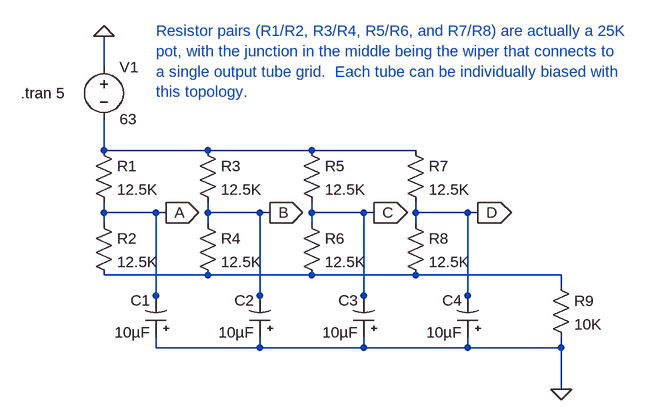
[diagram p0: schematic Individual_Bias_Network.asc]
Individual_Bias_Network.asc, the LTspice schematic file:
Version 4
SHEET 1 1040 680
WIRE 224 48 224 0
WIRE 224 176 224 128
WIRE 384 176 224 176
WIRE 544 176 384 176
WIRE 704 176 544 176
WIRE 224 272 224 256
WIRE 304 272 224 272
WIRE 320 272 304 272
WIRE 384 272 384 256
WIRE 464 272 384 272
WIRE 480 272 464 272
WIRE 544 272 544 256
WIRE 624 272 544 272
WIRE 640 272 624 272
WIRE 704 272 704 256
WIRE 784 272 704 272
WIRE 800 272 784 272
WIRE 224 288 224 272
WIRE 384 288 384 272
WIRE 544 288 544 272
WIRE 704 288 704 272
WIRE 384 368 224 368
WIRE 544 368 384 368
WIRE 704 368 544 368
WIRE 928 368 704 368
WIRE 928 384 928 368
WIRE 304 400 304 272
WIRE 464 400 464 272
WIRE 624 400 624 272
WIRE 784 400 784 272
WIRE 304 416 304 400
WIRE 464 416 464 400
WIRE 624 416 624 400
WIRE 784 416 784 400
WIRE 304 480 304 464
WIRE 464 480 464 464
WIRE 464 480 304 480
WIRE 624 480 624 464
WIRE 624 480 464 480
WIRE 784 480 784 464
WIRE 784 480 624 480
WIRE 928 480 928 464
WIRE 928 480 784 480
WIRE 928 544 928 480
FLAG 928 544 0
FLAG 224 0 0
FLAG 320 272 A
IOPIN 320 272 Out
FLAG 480 272 B
IOPIN 480 272 Out
FLAG 640 272 C
IOPIN 640 272 Out
FLAG 800 272 D
IOPIN 800 272 Out
SYMBOL res 208 160 R0
SYMATTR InstName R1
SYMATTR Value 12.5K
SYMBOL res 208 272 R0
SYMATTR InstName R2
SYMATTR Value 12.5K
SYMBOL res 368 160 R0
SYMATTR InstName R3
SYMATTR Value 12.5K
SYMBOL res 368 272 R0
SYMATTR InstName R4
SYMATTR Value 12.5K
SYMBOL res 528 160 R0
SYMATTR InstName R5
SYMATTR Value 12.5K
SYMBOL res 528 272 R0
SYMATTR InstName R6
SYMATTR Value 12.5K
SYMBOL res 688 160 R0
SYMATTR InstName R7
SYMATTR Value 12.5K
SYMBOL res 688 272 R0
SYMATTR InstName R8
SYMATTR Value 12.5K
SYMBOL res 912 368 R0
SYMATTR InstName R9
SYMATTR Value 10K
SYMBOL polcap 320 464 R180
WINDOW 0 24 57 Left 2
WINDOW 3 24 8 Left 2
SYMATTR InstName C1
SYMATTR Value 10µF
SYMBOL polcap 480 464 R180
WINDOW 0 24 57 Left 2
WINDOW 3 24 8 Left 2
SYMATTR InstName C2
SYMATTR Value 10µF
SYMBOL polcap 640 464 R180
WINDOW 0 24 57 Left 2
WINDOW 3 24 8 Left 2
SYMATTR InstName C3
SYMATTR Value 10µF
SYMBOL polcap 800 464 R180
WINDOW 0 24 57 Left 2
WINDOW 3 24 8 Left 2
SYMATTR InstName C4
SYMATTR Value 10µF
SYMBOL voltage 224 32 R0
SYMATTR InstName V1
SYMATTR Value 63
TEXT 96 88 Left 2 !.tran 5
TEXT 304 -8 Left 2 ;Resistor pairs (R1/R2, R3/R4, R5/R6, and R7/R8) are actually a 25K\npot, with the junction in the middle being the wiper that connects to\na single output tube grid.  Each tube can be individually biased with\nthis topology.

The netlist it stands for:
* Individual_Bias_Network.asc
R1 N001 A 12.5K
R2 A N002 12.5K
R3 N001 B 12.5K
R4 B N002 12.5K
R5 N001 C 12.5K
R6 C N002 12.5K
R7 N001 D 12.5K
R8 D N002 12.5K
R9 N002 0 10K
C1 0 A 10µF
C2 0 B 10µF
C3 0 C 10µF
C4 0 D 10µF
V1 0 N001 63
.tran 5
* Resistor pairs (R1/R2, R3/R4, R5/R6, and R7/R8) are actually a 25K
* pot, with the junction in the middle being the wiper that connects to
* a single output tube grid.  Each tube can be individually biased with
* this topology.
.backanno
.end